# EasyEDA schematic Schematic.json
TITLE: Sheet_1; REV: 1.0; Date: 2021-05-25; Sheet: 1/1; Company: Your Company
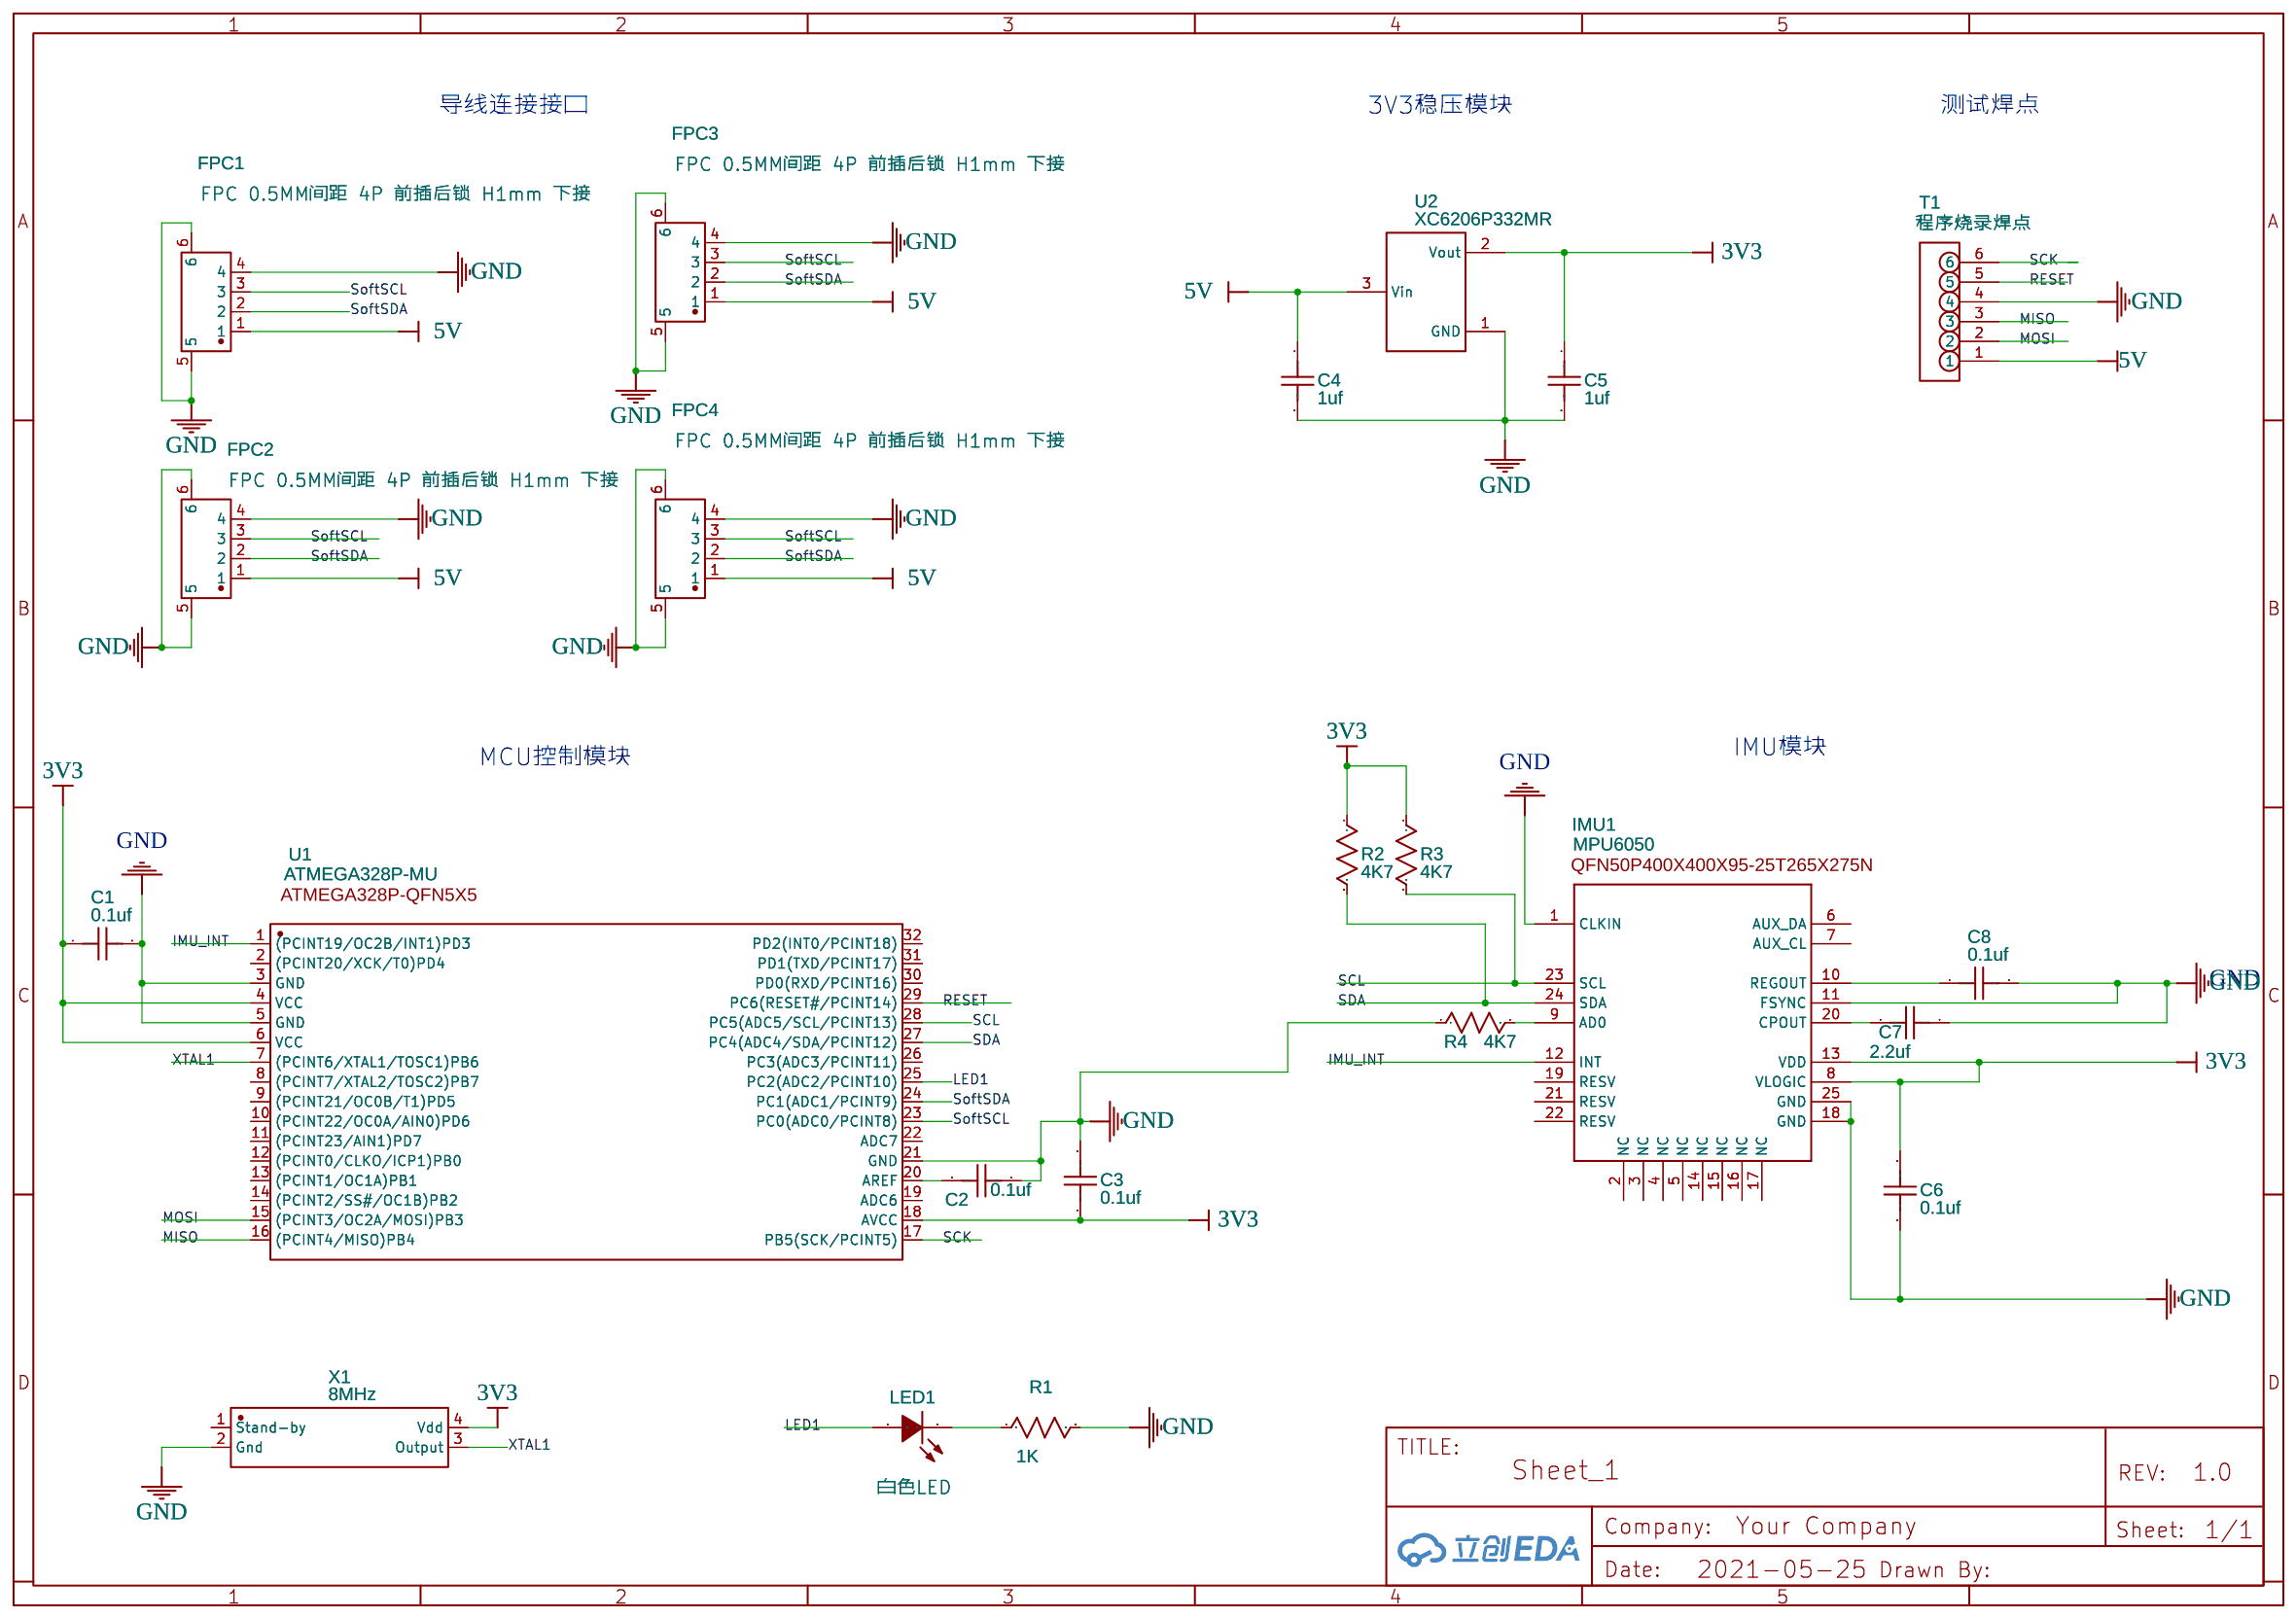
[diagram p0: schematic sheet]

## Parts
C1  0.1uf  [C0201]
C2  0.1uf  [C0201]
C3  0.1uf  [C0201]
C4  1uf  [C0201]
C5  1uf  [C0201]
C6  0.1uf  [C0201]
C7  2.2uf  [C0201]
C8  0.1uf  [C0201]
FPC1  FPC 0.5MM间距 4P 前插后锁 H1mm 下接  [FPC-0.5MM-4P-H1.0]
FPC2  FPC 0.5MM间距 4P 前插后锁 H1mm 下接  [FPC-0.5MM-4P-H1.0]
FPC3  FPC 0.5MM间距 4P 前插后锁 H1mm 下接  [FPC-0.5MM-4P-H1.0]
FPC4  FPC 0.5MM间距 4P 前插后锁 H1mm 下接  [FPC-0.5MM-4P-H1.0]
IMU1  MPU6050  [QFN50P400X400X95-25T265X275N]
LED1  白色LED  [LED0402]
R1  1K  [R0201]
R2  4K7  [R0201]
R3  4K7  [R0201]
R4  4K7  [R0201]
T1  程序烧录焊点  [TEST]
U1  ATMEGA328P-MU  [ATMEGA328P-QFN5X5]
U2  XC6206P332MR  [SOT-23-3_L2.9-W1.6-P1.90-LS2.8-BR]
X1  8MHz  [OSC-SMD_4P-L1.6-W1.2-BL]

## Library data of the parts
C1-C8 = C_0402_US: Contributor: LCEDA_Lib
FPC1-FPC4 = FPC 0.5MM 4P 翻盖式 H2.0: Supplier: LCSC; Supplier Part: C9345; Manufacturer: ATOM(爱特姆); Contributor: LCSC; JLCPCB Part Class: Extended Part
IMU1 = MPU6050: Package Display: Yes
LED1 = 19-217/BHC-XL2M2TY/3T: Supplier: LCSC; Supplier Part: C264464; Manufacturer: Everlight Elec; Contributor: LCSC; Paste Type: expand
R1-R4 = R_0402_US: Contributor: LCEDA_Lib
T1 = Test: Contributor: Guest
U1 = ATMEGA328P-AU: Supplier: LCSC; Manufacturer: MICROCHIP; image: //image.lceda.cn/szlcsc/C14877.jpg; Supplier Part: C14877; Paste Type: base; Package Display: Yes
U2 = XC6206P332MR: Supplier: LCSC; Manufacturer: TOREX; image: //image.lceda.cn/szlcsc/C5446.jpg; Supplier Part: C5446; Paste Type: base
X1 = ECS-1612MV-080-CN-TR: Supplier: LCSC; Supplier Part: C405436; Manufacturer: ECS; Contributor: LCSC; JLCPCB Part Class: Extended Part

## Nets
3V3: C1.1 C3.1 C5.1 C6.1 IMU1.8(VLOGIC) IMU1.13(VDD) R2.1 R3.1 U1.4(VCC) U1.6(VCC) U1.18(AVCC) U2.2(Vout) X1.4(Vdd)
5V: C4.1 FPC1.1 FPC2.1 FPC3.1 FPC4.1 T1.1 U2.3(Vin)
GND: C1.2 C2.1 C3.2 C4.2 C5.2 C6.2 C7.1 C8.2 FPC1.4 FPC1.5 FPC1.6 FPC2.4 FPC2.5 FPC2.6 FPC3.4 FPC3.5 FPC3.6 FPC4.4 FPC4.5 FPC4.6 IMU1.1(CLKIN) IMU1.11(FSYNC) IMU1.18(GND) IMU1.25(GND) R1.2 R4.1 T1.4 U1.3(GND) U1.5(GND) U1.21(GND) U2.1(GND) X1.2(Gnd)
IMU_INT: IMU1.12(INT) U1.1((PCINT19/OC2B/INT1)PD3)
LED1: LED1.1(A) U1.25(PC2(ADC2/PCINT10))
MISO: T1.3 U1.16((PCINT4/MISO)PB4)
MOSI: T1.2 U1.15((PCINT3/OC2A/MOSI)PB3)
RESET: T1.5 U1.29(PC6(RESET#/PCINT14))
SCK: T1.6 U1.17(PB5(SCK/PCINT5))
SCL: IMU1.23(SCL) R3.2 U1.28(PC5(ADC5/SCL/PCINT13))
SDA: IMU1.24(SDA) R2.2 U1.27(PC4(ADC4/SDA/PCINT12))
SoftSCL: FPC1.3 FPC2.3 FPC3.3 FPC4.3 U1.23(PC0(ADC0/PCINT8))
SoftSDA: FPC1.2 FPC2.2 FPC3.2 FPC4.2 U1.24(PC1(ADC1/PCINT9))
XTAL1: U1.7((PCINT6/XTAL1/TOSC1)PB6) X1.3(Output)
Net-(C2-2): C2.2 U1.20(AREF)
Net-(C7-2): C7.2 IMU1.20(CPOUT)
Net-(C8-1): C8.1 IMU1.10(REGOUT)
Net-(IMU1-9): IMU1.9(AD0) R4.2
Net-(LED1-2): LED1.2(K) R1.1

Not connected (* = marked no-connect by the designer): IMU1 2(NC) 3(NC) 4(NC) 5(NC) 6(AUX_DA) 7(AUX_CL) 14(NC) 15(NC) 16(NC) 17(NC) 19(RESV) 21(RESV) 22(RESV); U1 2((PCINT20/XCK/T0)PD4) 8((PCINT7/XTAL2/TOSC2)PB7) 9((PCINT21/OC0B/T1)PD5) 10((PCINT22/OC0A/AIN0)PD6) 11((PCINT23/AIN1)PD7) 12((PCINT0/CLKO/ICP1)PB0) 13((PCINT1/OC1A)PB1) 14((PCINT2/SS#/OC1B)PB2) 19(ADC6) 22(ADC7) 26(PC3(ADC3/PCINT11)) 30(PD0(RXD/PCINT16)) 31(PD1(TXD/PCINT17)) 32(PD2(INT0/PCINT18)); X1 1(Stand-by)

## Notes on the sheet
- 导线连接接口
- 3V3稳压模块
- 测试焊点
- MCU控制模块
- IMU模块
- GND
